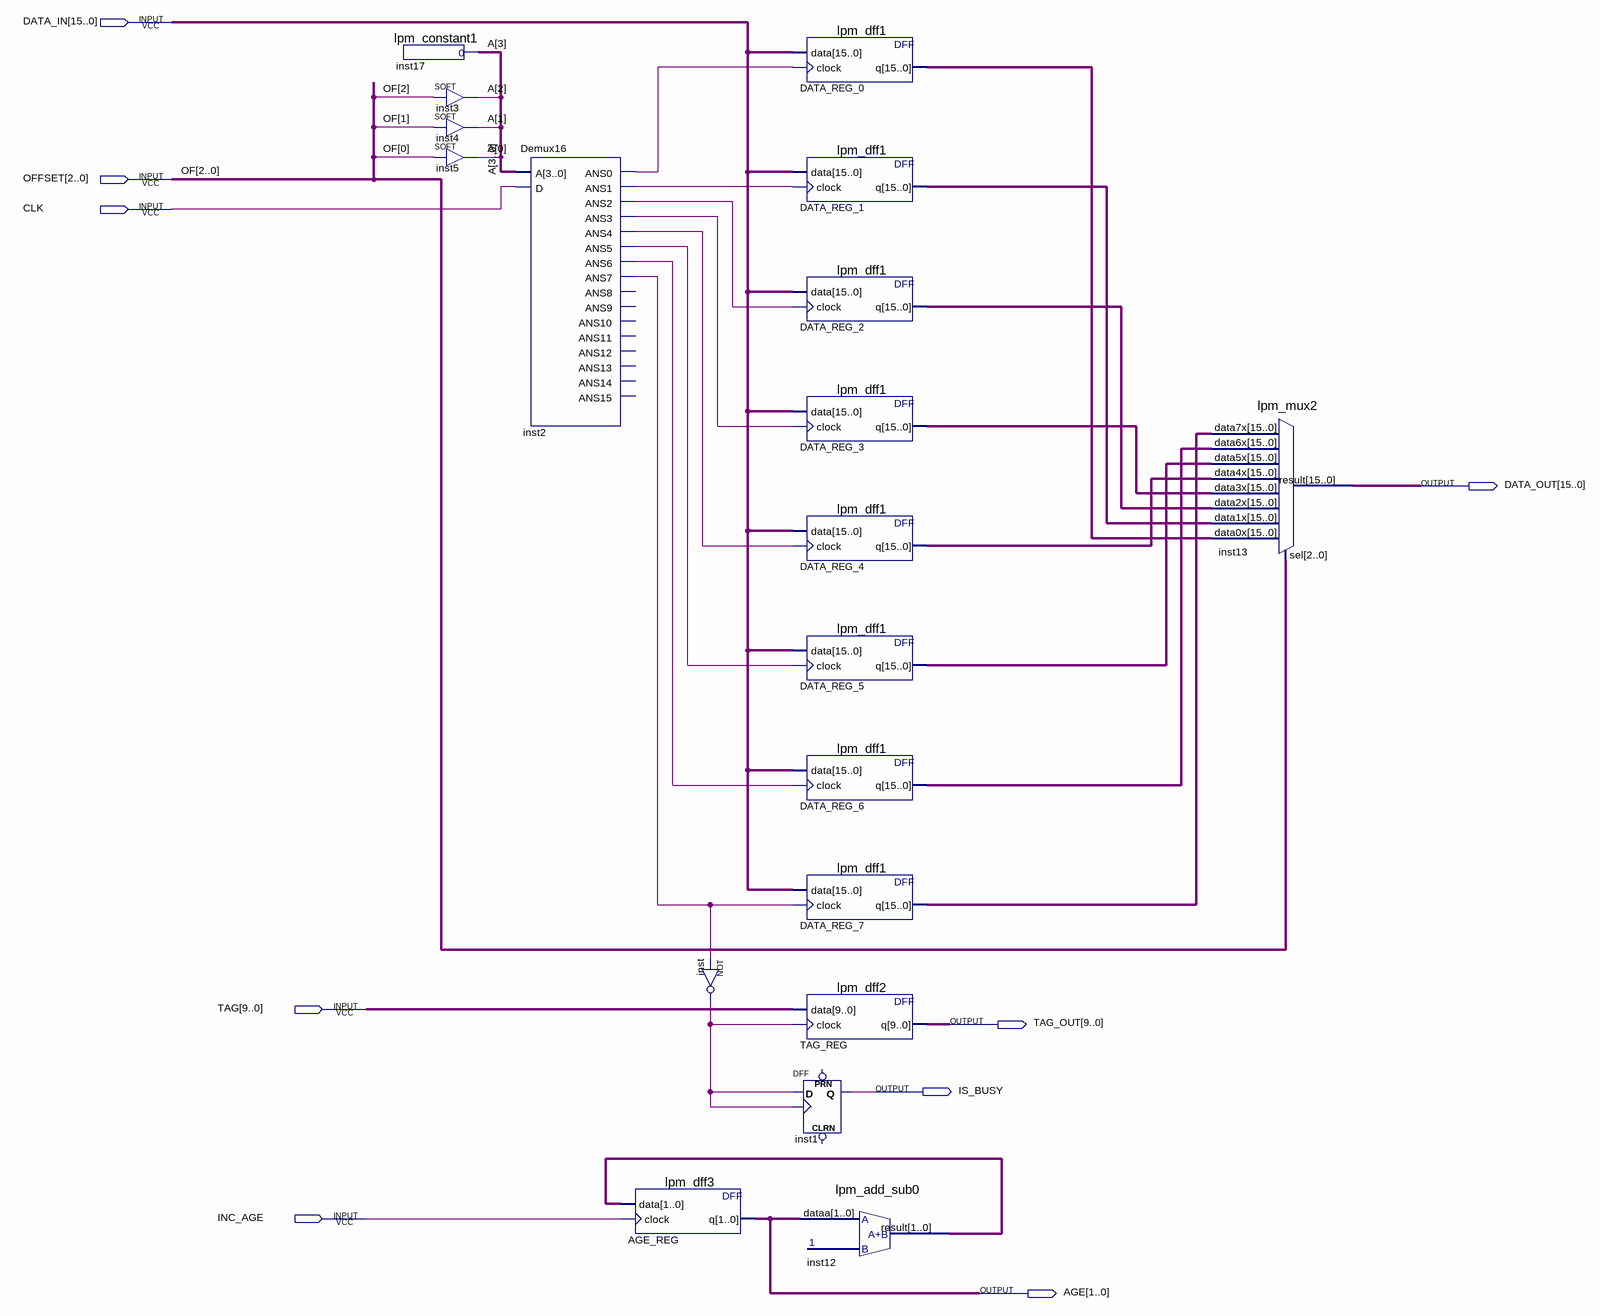
[diagram p0: schematic sheet]
// Quartus schematic String.bdf as structural Verilog: 19 symbols, 9 pins
module String (
  input  [15:0] DATA_IN,
  input  [2:0] OFFSET,
  input  CLK,
  input  [9:0] TAG,
  input  INC_AGE,
  output [15:0] DATA_OUT,
  output [9:0] TAG_OUT,
  output IS_BUSY,
  output [1:0] AGE
);

  wire inst2_ans0, inst2_ans1, inst2_ans2, inst2_ans3, inst2_ans4, inst2_ans5, inst2_ans6, inst2_ans7,
       inst_out;
  wire [1:0] inst12_result;
  wire [3:0] A;
  wire [15:0] DATA_REG_0_q, DATA_REG_1_q, DATA_REG_2_q, DATA_REG_3_q, DATA_REG_4_q, DATA_REG_5_q,
       DATA_REG_6_q, DATA_REG_7_q;

  lpm_constant1 inst17 (.result(A[3]));
  SOFT inst3 (.IN(OFFSET[2]), .OUT(A[2]));
  SOFT inst4 (.IN(OFFSET[1]), .OUT(A[1]));
  SOFT inst5 (.IN(OFFSET[0]), .OUT(A[0]));
  Demux16 inst2 (
    .A(A), .D(CLK), .ANS0(inst2_ans0), .ANS1(inst2_ans1), .ANS2(inst2_ans2), .ANS3(inst2_ans3),
    .ANS4(inst2_ans4), .ANS5(inst2_ans5), .ANS6(inst2_ans6), .ANS7(inst2_ans7));  // open: ANS8, ANS9, ANS10, ANS11, ANS12, ANS13, ANS14, ANS15
  lpm_dff3 AGE_REG (.data(inst12_result), .clock(INC_AGE), .q(AGE));
  not inst (inst_out, inst2_ans7);
  lpm_dff1 DATA_REG_0 (.data(DATA_IN), .clock(inst2_ans0), .q(DATA_REG_0_q));
  lpm_dff1 DATA_REG_1 (.data(DATA_IN), .clock(inst2_ans1), .q(DATA_REG_1_q));
  lpm_dff1 DATA_REG_2 (.data(DATA_IN), .clock(inst2_ans2), .q(DATA_REG_2_q));
  lpm_dff1 DATA_REG_3 (.data(DATA_IN), .clock(inst2_ans3), .q(DATA_REG_3_q));
  lpm_dff1 DATA_REG_4 (.data(DATA_IN), .clock(inst2_ans4), .q(DATA_REG_4_q));
  lpm_dff1 DATA_REG_5 (.data(DATA_IN), .clock(inst2_ans5), .q(DATA_REG_5_q));
  lpm_dff1 DATA_REG_6 (.data(DATA_IN), .clock(inst2_ans6), .q(DATA_REG_6_q));
  lpm_dff1 DATA_REG_7 (.data(DATA_IN), .clock(inst2_ans7), .q(DATA_REG_7_q));
  lpm_dff2 TAG_REG (.data(TAG), .clock(inst_out), .q(TAG_OUT));
  DFF inst1 (.CLK(inst_out), .D(inst_out), .Q(IS_BUSY));  // open: CLRN, PRN
  lpm_add_sub0 inst12 (.dataa(AGE), .result(inst12_result));
  lpm_mux2 inst13 (
    .data7x(DATA_REG_7_q), .data6x(DATA_REG_6_q), .data5x(DATA_REG_5_q), .data4x(DATA_REG_4_q),
    .data3x(DATA_REG_3_q), .data2x(DATA_REG_2_q), .data1x(DATA_REG_1_q), .data0x(DATA_REG_0_q), .sel(OFFSET),
    .result(DATA_OUT));

  // Other names for the same wires on the sheet: OF[2:0] = OFFSET
endmodule
